# Altium schematic sheet Sheet5.SchDoc
size A4; SheetNumber: 3; SheetTotal: 3
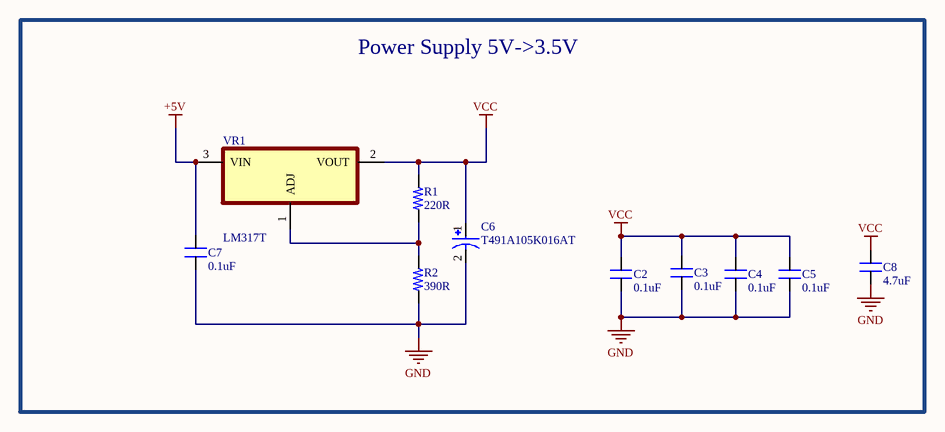
[diagram p0: Sheet5.SchDoc]

## Parts
C2  0.1uF  [CAP_0805]
C3  0.1uF  [CAP_0805]
C4  0.1uF  [CAP_0805]
C5  0.1uF  [CAP_0805]
C6  T491A105K016AT  [CAPMP3216X180N - duplicate]
C7  0.1uF  [CAP_0805]
C8  4.7uF  [CAP_0805]
R1  220R  [RES_0805]
R2  390R  [RES_0805]
VR1  LM317T  [TO254P1054X470X1955-3]

## Blocks framed on the sheet
Power Supply 5V->3.5V: C2-C8 R1 R2 VR1

## Nets
+5V: C7.2 VR1.3(VIN)
GND: C2.1 C3.1 C4.1 C5.1 C6.2 C7.1 C8.1 R2.1
VCC: C2.2 C3.2 C4.2 C5.2 C6.1 C8.2 R1.2 VR1.2(VOUT)
NetR1_1: R1.1 R2.2 VR1.1(ADJ)

## Library data of the parts
C2-C5 C7 = CAP_0.1uF-50V-5%-0805: 0.1µF ±5% 50V Ceramic Capacitor X7R 0805 (2012 Metric); Manufacturer: KEMET; Manufacturing Part Number: C0805C104J5RACTU; Case/Package: 0805 (2012 Metric); Supplier-1: Digikey; Supplier Part Number-1: 399-1171-1-ND
C6 = T491A105K016AT: 1ÂµF Molded Tantalum Capacitors 16V 1206 (3216 Metric) 10Ohm; MF: Kemet; Check_prices: https://www.snapeda.com/parts/T491A105K016AT/Kemet/view-part/31713/?ref=eda; Purchase-URL: https://pricing.snapeda.com/search/part/T491A105K016AT/?ref=eda; SnapEDA_Link: https://www.snapeda.com/parts/T491A105K016AT/Kemet/view-part/31713/?ref=snap; Price: None; Package: 1206 Kemet; Availability: Warning; Value: *; MP: T491A105K016AT
C8 = CAP_4.7uF-50V-5%-0805_1: 0.1µF ±5% 50V Ceramic Capacitor X7R 0805 (2012 Metric); Manufacturer: KEMET; Manufacturing Part Number: C0805C104J5RACTU; Case/Package: 0805 (2012 Metric); Supplier-1: Digikey; Supplier Part Number-1: 399-1171-1-ND
R1 = RES_220R-0.125W-1%-0805_1_1_1: 220 Ohms ±1% 0.125W, 1/8W Chip Resistor 0805 (2012 Metric) Thick Film; Manufacturer: TE Connectivity Passive Product; Manufacturing Part Number: CRG0805F1K5; Case/Package: 0805; Supplier-1: Digikey; Supplier Part Number-1: A106057CT-ND
R2 = RES_390R-0.125W-1%-0805_1_1: 390Ohms ±1% 0.125W, 1/8W Chip Resistor 0805 (2012 Metric) Thick Film; Manufacturer: TE Connectivity Passive Product; Manufacturing Part Number: CRG0805F1K5; Case/Package: 0805; Supplier-1: Digikey; Supplier Part Number-1: A106057CT-ND
VR1 = LM317T: 1.5-A, 40-V, adjustable linear voltage regulator 3-TO-220; MF: Texas Instruments; Price: None; Availability: In Stock; Package: TO-220-3 Texas Instruments; MP: LM317T; Value: *; SnapEDA_Link: https://www.snapeda.com/parts/LM317T/Texas+Instruments/view-part/?ref=snap; Purchase-URL: https://pricing.snapeda.com/search/part/LM317T/?ref=eda; Check_prices: https://www.snapeda.com/parts/LM317T/Texas+Instruments/view-part/?ref=eda